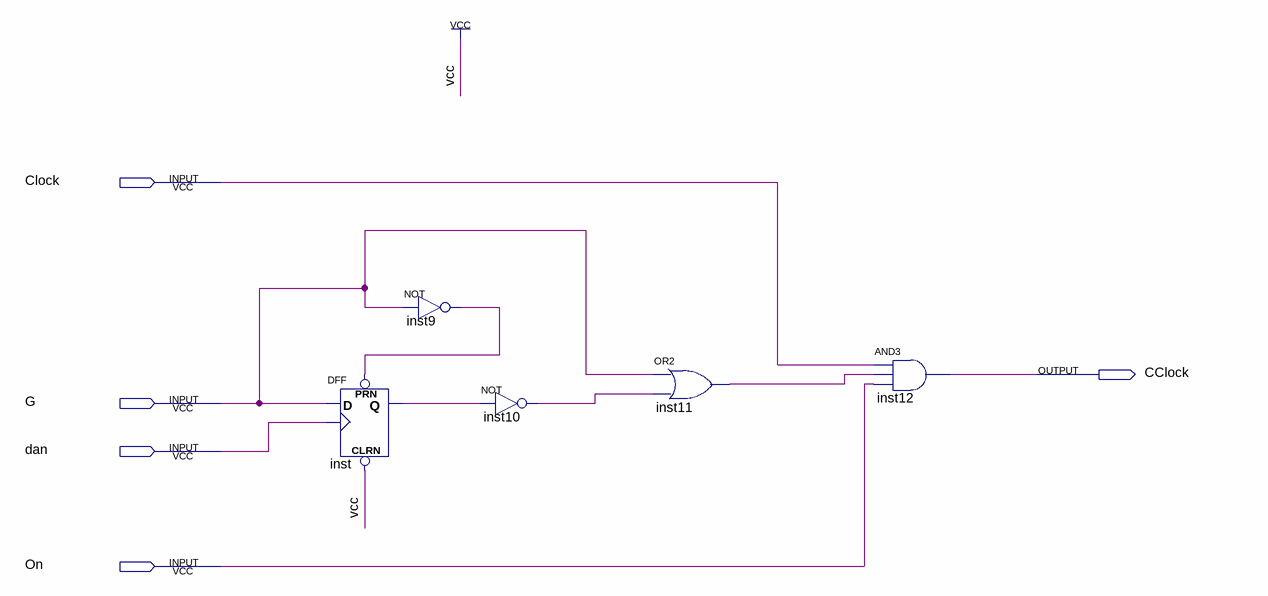
[diagram p0: schematic sheet]
// Quartus schematic On_Off.bdf as structural Verilog: 5 symbols, 5 pins
module On_Off (
  input  Clock,
  input  G,
  input  dan,
  input  On,
  output CClock
);

  wire inst9_out, inst10_out, inst11_out, inst_q;

  DFF inst (.CLRN(1'b1), .CLK(dan), .D(G), .PRN(inst9_out), .Q(inst_q));
  not inst9 (inst9_out, G);
  not inst10 (inst10_out, inst_q);
  or inst11 (inst11_out, G, inst10_out);
  and inst12 (CClock, Clock, inst11_out, On);
endmodule
